# Altium schematic sheet LIS3MDL.SchDoc
size A; SheetNumber: 7; SheetTotal: 7
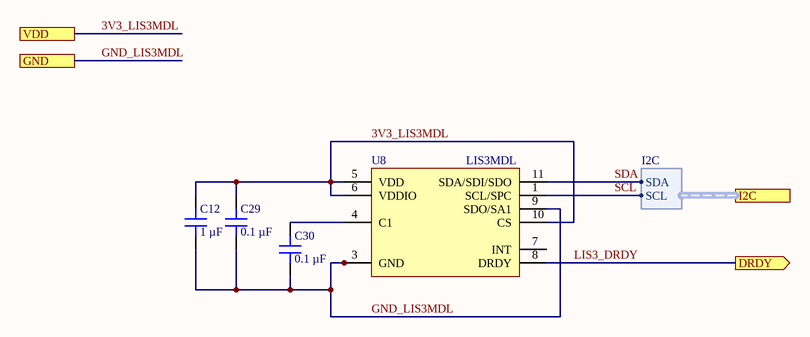
[diagram p0: LIS3MDL.SchDoc]

## Parts
C12  1 µF  [CAP 0402_1005]
C29  0.1 µF  [CAP 0402_1005]
C30  0.1 µF  [CAP 0402_1005]
U8  LIS3MDL  [LGA12_ST]

## Ports
DRDY (out), GND, I2C (harness I2C), VDD

## Harnesses
I2C: SCL, SDA

## Nets
3V3_LIS3MDL: C12.1 C29.1 U8.5(VDD) U8.6(VDDIO) U8.10(CS) ; port VDD
GND_LIS3MDL: C12.2 C29.2 C30.2 U8.2(Reserved) U8.3(GND) U8.9(SDO/SA1) U8.12(Reserved) ; port GND
LIS3_DRDY: U8.8(DRDY) ; port DRDY
SCL: U8.1(SCL/SPC) ; port I2C.SCL
SDA: U8.11(SDA/SDI/SDO) ; port I2C.SDA
NetC30_1: C30.1 U8.4(C1)

Not connected (* = marked no-connect by the designer): U8 7(INT)

## Library data of the parts
C12 = C0402C104K4RACAUTO: CAP CER 0.1UF 16V X7R 0402; manufacturer: KEMET; Capacitance: 0.1 µF; Tolerance: ±10%; Part Number: C0402C104K4RACAUTO; Value: 1 µF; Applications: Automotive, Bypass, Decoupling; componentlink1description: Datasheet; componentlink1url: https://api.kemet.com/component-edge/download/specsheet/C0402C104K4RACAUTO.pdf; componentlink2description: DigiKey Link; componentlink2url: https://www.digikey.com/en/products/detail/kemet/C0402C104K4RACAUTO/3314827; Device Package: 0402 (1005 Metric); lastupdated: 8/14/2022 9:05:51 PM; Lifecycle Status: Active; Minimum Order: 1; Mounting Type: Surface Mount, MLCC; Operating Temperature: -55°C ~ 125°C; Package / Case: 0402 (1005 Metric); packaging: TapeAndReel; partid: 3024; Part Status: Active; price: 0.01; Ratings: AEC-Q200; series: SMD Auto X7R; Size / Dimension: 0.039" L x 0.020" W (1.00mm x 0.50mm); Supplier 1: DigiKey; Supplier Part Number 1: 399-6828-1-ND; Temperature Coefficient: X7R; Thickness (Max): 0.022" (0.55mm); Voltage - Rated: 16V
C29 C30 = C0402C104K4RACAUTO: CAP CER 0.1UF 16V X7R 0402; manufacturer: KEMET; Tolerance: ±10%; Part Number: C0402C104K4RACAUTO; Value: 0.1 µF; Applications: Automotive, Bypass, Decoupling; Capacitance: 0.1 µF; componentlink1description: Datasheet; componentlink1url: https://api.kemet.com/component-edge/download/specsheet/C0402C104K4RACAUTO.pdf; componentlink2description: DigiKey Link; componentlink2url: https://www.digikey.com/en/products/detail/kemet/C0402C104K4RACAUTO/3314827; Device Package: 0402 (1005 Metric); lastupdated: 8/14/2022 9:05:51 PM; Lifecycle Status: Active; Minimum Order: 1; Mounting Type: Surface Mount, MLCC; Operating Temperature: -55°C ~ 125°C; Package / Case: 0402 (1005 Metric); packaging: TapeAndReel; partid: 3024; Part Status: Active; price: 0.01; Ratings: AEC-Q200; series: SMD Auto X7R; Size / Dimension: 0.039" L x 0.020" W (1.00mm x 0.50mm); Supplier 1: DigiKey; Supplier Part Number 1: 399-6828-1-ND; Temperature Coefficient: X7R; Thickness (Max): 0.022" (0.55mm); Voltage - Rated: 16V
U8 = LIS3MDL: Magnetometer